# Altium schematic sheet PowerSupply.SchDoc: =ProjectName
size 420 x 297 mm; Author: SBH; CompanyName: WUT; DrawnBy: SBH; Organization: ISE-WUT; Address1: Warsaw Univeristy of Technology; Address2: Nowowiejska 15/19; Revision: -; SheetNumber: -; SheetTotal: -; EDA_Number: ARTIQ; Projet: ADC/DAC MEZZANINE; ModifiedBy: -; CreateDate: XX/XX/XXXX; CheckedDate: -; Title2: PowerSupply.SchDoc; DivGrp: ISE; Designer: SBH; ModifiedDate: -; ProjectName: ADC/DAC MEZZANINE
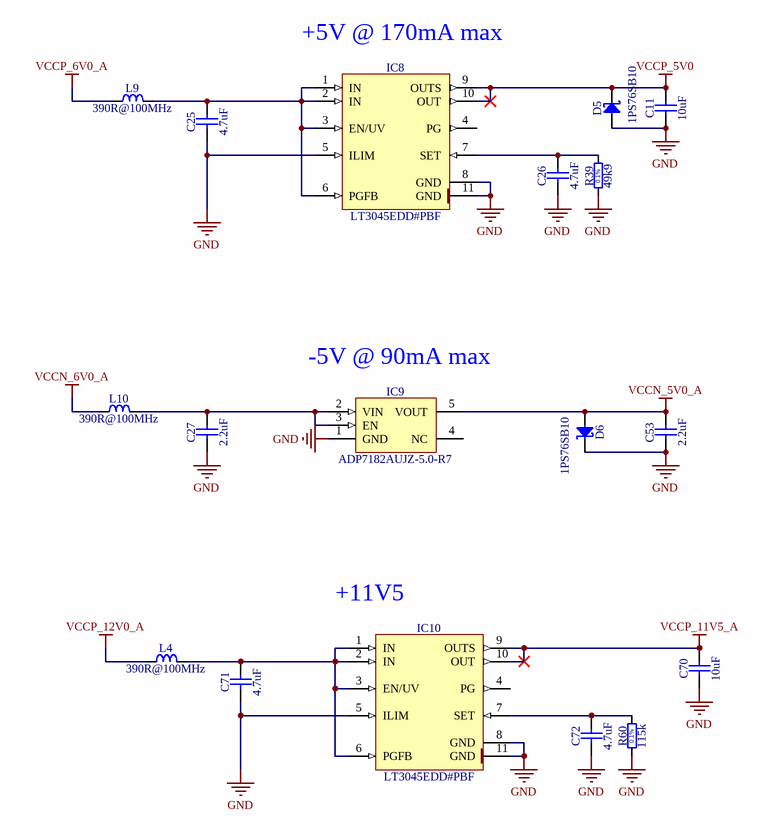
[diagram p0: PowerSupply.SchDoc]

## Parts
C11  10uF  [CAPC1608X87N]
C25  4.7uF  [CAPC1709X95N]
C26  4.7uF  [CAPC1709X95N]
C27  2.2uF  [CAPC1608X90N]
C53  2.2uF  [CAPC1608X90N]
C70  10uF  [CAPC1608X87N]
C71  4.7uF  [CAPC1709X95N]
C72  4.7uF  [CAPC1709X95N]
D5  1PS76SB10  [SOD2512X110N]
D6  1PS76SB10  [SOD2512X110N]
IC8  LT3045EDD#PBF  [SON50P300X300X80-11N-R175X248]
IC9  ADP7182AUJZ-5.0-R7  [SOT95P280X90-5N]
IC10  LT3045EDD#PBF  [SON50P300X300X80-11N-R175X248]
L4  390R@100MHz  [INDC1608X95N]
L9  390R@100MHz  [INDC1608X95N]
L10  390R@100MHz  [INDC1608X95N]
R39  49k9  [RESC1608X55N]
R60  115k  [RESC1608X55N]

## Nets
GND: C11.1 C25.1 C26.1 C27.1 C53.1 C70.1 C71.1 C72.1 D5.2(A) D6.1(C) IC8.5(ILIM) IC8.8(GND) IC8.11(GND) IC9.1(GND) IC10.5(ILIM) IC10.8(GND) IC10.11(GND) R39.1 R60.1
VCCN_5V0_A: C53.2 D6.2(A) IC9.5(VOUT)
VCCN_6V0_A: L10.1
VCCP_5V0: C11.2 D5.1(C) IC8.9(OUTS) IC8.10(OUT)
VCCP_6V0_A: L9.1
VCCP_11V5_A: C70.2 IC10.9(OUTS) IC10.10(OUT)
VCCP_12V0_A: L4.1
NetC25_2: C25.2 IC8.1(IN) IC8.2(IN) IC8.3(EN/UV) IC8.6(PGFB) L9.2
NetC26_2: C26.2 IC8.7(SET) R39.2
NetC27_2: C27.2 IC9.2(VIN) IC9.3(EN) L10.2
NetC71_2: C71.2 IC10.1(IN) IC10.2(IN) IC10.3(EN/UV) IC10.6(PGFB) L4.2
NetC72_2: C72.2 IC10.7(SET) R60.2

Not connected (* = marked no-connect by the designer): IC8 4(PG); IC9 4(NC); IC10 4(PG)

## Notes on the sheet
- (near IC8) +5V @ 170mA max
- (near IC9) -5V @ 90mA max
- (near IC10) +11V5
- Project/Equipment
- Document
- Designer
- Drawn by
- Check.by
- File
- Last Mod.
- Print Date
- Sheet
- Size
- A3
- of
- Rev
- (in symbol R0603_49K9_0.1%_0.063W_10PPM) 0.1%
- (in symbol R0603_115K_0.1%_0.063W_10PPM) 0.1%

## Library data of the parts
C11 C70 = CC0603_10UF_6.3V_20%_X5R: Non-polarised capacitor; Part Description: SMD Multilayer Chip Ceramic Capacitor; Manufacturer: GENERIC; Manufacturer1 Part Number: C0603C106M9PAC; Voltage: 6.3V; TC: X5R; Tolerance: ±20%; Part Number: CC0603_10UF_6.3V_20%_X5R; Component Kind: Standard; Component Type: Standard; Pin Count: 2; Value: 10uF; Status: Preferred; Manufacturer Part Number: CC0603_10uF_6.3V_20%_X5R; Case: 0603; Mounted: Yes; Socket: No; SMD: Yes; Sense: No; Manufacturer1 Example: KEMET; Manufacturer1 ComponentHeight: 0.95mm; HelpURL: \\cern.ch\dfs\Applications\Altium\Datasheets\CC0603_X5R_KEMET.pdf; Author: CERN DEM JLC; CreateDate: 2007-12-03; LatestRevisionDate: 2007-12-03
C25 C26 C71 C72 = CC0603_4.7UF_16V_10%_X5R: Non-polarised capacitor; Part Description: SMD Multilayer Chip Ceramic Capacitor; Manufacturer: GENERIC; Manufacturer1 Part Number: EMK107ABJ475KA-T; Voltage: 16V; TC: X5R; Tolerance: ±10%; Part Number: CC0603_4.7UF_16V_10%_X5R; Component Kind: Standard; Component Type: Standard; Pin Count: 2; Value: 4.7uF; Status: None; Manufacturer Part Number: CC0603_4.7UF_16V_10%_X5R; Case: 0603; Mounted: Yes; Socket: No; SMD: Yes; Sense: No; Manufacturer1 Example: TAIYO YUDEN; Manufacturer1 ComponentHeight: 0.95mm; HelpURL: \\cern.ch\dfs\Applications\Altium\Datasheets\CC0603_X7R_TAIYO-YUDEN_HIGH-VALUE.pdf; Author: CERN DEM JLC; CreateDate: 2013-12-16; LatestRevisionDate: 2014-09-16
C27 C53 = CC0603_2.2UF_10V_20%_X7R: Non-polarised capacitor; Part Description: SMD Multilayer Chip Ceramic Capacitor; Manufacturer: GENERIC; Manufacturer1 Part Number: LMK107B7225MA-T; Voltage: 10V; TC: X7R; Tolerance: ±20%; Part Number: CC0603_2.2UF_10V_20%_X7R; Component Kind: Standard; Component Type: Standard; Pin Count: 2; Value: 2.2uF; Status: Not Recommended; Manufacturer Part Number: CC0603_2.2UF_10V_20%_X7R; Case: 0603; Mounted: Yes; Socket: No; SMD: Yes; Sense: No; Manufacturer1 Example: TAIYO YUDEN; Manufacturer1 ComponentHeight: 0.9mm; HelpURL: \\cern.ch\dfs\Applications\Altium\Datasheets\CC0603_X7R_TAIYO-YUDEN_HIGH-VALUE.pdf; Author: CERN DEM JLC; CreateDate: 2011-06-22; LatestRevisionDate: 2011-06-27
D5 D6 = 1PS76SB10: Schottky Diode; Part Description: Schottky Barrier Single Diode; Manufacturer: NXP SEMICONDUCTORS; Voltage: 30V; Power: 200mA; PressFit: No; Bonding: No; Part Number: 1PS76SB10; Component Kind: Standard; Component Type: Standard; Device: 1PS76SB10; PackageDescription: Small Outline Diode Flat Lead (SOD-323), 1.70mm W X 1.25mm L X 1.10mm H body,  IPC Medium Density; Manufacturer Part Number: 1PS76SB10; Pin Count: 2; Case: SOD323; Mounted: Yes; Socket: No; SMD: Yes; Sense: No; ComponentHeight: 1.1mm; HelpURL: \\cern.ch\dfs\Applications\Altium\Datasheets\1PS76SB10.pdf; Author: CERN DEM JLC; CreateDate: 2012-12-06; LatestRevisionDate: 2012-12-06
IC8 IC10 = LT3045EDD#PBF: 20V, 500mA, Ultralow Noise, Ultrahigh PSRR Linear Regulator; Manufacturer: LINEAR TECHNOLOGY; PressFit: No; Bonding: No; Part Number: LT3045EDD#PBF; Component Kind: Standard; Component Type: Standard; Device: LT3045EDD#PBF; PackageDescription: SON, 0.50mm Pitch, 10-pin, 3.00mm W  X 3.00mm L X 0.80mm Height, (w/thermal tab 1.75 X 2.48 mm), IPC Medium Density; Part Description: 20V, 500mA, Ultralow Noise, Ultrahigh PSRR Linear Regulator; Manufacturer Part Number: LT3045EDD#PBF; Pin Count: 11; Case: SON10; Mounted: Yes; Socket: No; SMD: Yes; Sense: No; ComponentHeight: 0.8mm; HelpURL: \\cern.ch\dfs\Applications\Altium\Datasheets\LT3045EDD#PBF.pdf; Author: CERN DEM JLC; CreateDate: 2016-12-07; LatestRevisionDate: 2016-12-07
IC9 = ADP7182AUJZ-5.0-R7: –5V, 200 mA, Low Noise, Linear Regulator; Part Description: –5V, -200mA, Low Noise, Linear Regulator; Manufacturer: ANALOG DEVICES; PressFit: No; Bonding: No; Part Number: ADP7182AUJZ-5.0-R7; Component Kind: Standard; Component Type: Standard; Device: ADP7182AUJZ-5.0-R7; PackageDescription: SOT23, 0.95mm pitch; 5 pin, 1.75mm W X 3.00mm L, IPC Medium Density; Manufacturer Part Number: ADP7182AUJZ-5.0-R7; Pin Count: 5; Case: SOT23-5; Mounted: Yes; Socket: No; SMD: Yes; Sense: No; ComponentHeight: 0.9mm; HelpURL: \\cern.ch\dfs\Applications\Altium\Datasheets\ADP7182AUJZ-5.0-R7.pdf; Author: CERN DEM JLC; CreateDate: 17.03.2014; LatestRevisionDate: 17.03.2014
L4 L9 L10 = IND0603_TDK_MPZ1608R391A: Inductor; Part Description: SMT Chip Bead for Power Line; Manufacturer: TDK; Power: 1.2A; Resistance: 0.12R; Tolerance: ±25%; Part Number: IND0603_TDK_MPZ1608R391A; Component Kind: Standard; Component Type: Standard; Pin Count: 2; Value: 390R@100MHz; Status: None; Manufacturer Part Number: MPZ1608R391A; Case: 0603; Mounted: Yes; Socket: No; SMD: Yes; Sense: No; ComponentHeight: 0.95mm; HelpURL: \\cern.ch\dfs\Applications\Altium\Datasheets\IND0603_TDK_MPZ1608.pdf; Author: CERN DEM JLC; CreateDate: 2009-12-02; LatestRevisionDate: 2009-12-02
R39 = R0603_49K9_0.1%_0.063W_10PPM: Resistor - 0.1%; Part Description: Thin Film Chip Resistor; Manufacturer: GENERIC; Manufacturer1 Part Number: RN73C1J49K9BTDF; Power: 0.063W; TC: ±10ppm; Part Number: R0603_49K9_0.1%_0.063W_10PPM; Component Kind: Standard; Component Type: Standard; Pin Count: 2; Value: 49k9; Status: Not recommended; Tolerance: ±0.1%; Manufacturer Part Number: R0603_49K9_0.1%_0.063W_10PPM; Case: 0603; Mounted: Yes; Sense: No; Socket: No; SMD: Yes; Manufacturer1 Example: TYCO HOLSWORTHY; Manufacturer1 ComponentHeight: 0.5mm; HelpURL: \\cern.ch\dfs\Applications\Altium\Datasheets\R0603_Tyco_RN73.pdf; Author: CERN DEM JLC; CreateDate: 2007-12-03; LatestRevisionDate: 2008-03-13
R60 = R0603_115K_0.1%_0.063W_10PPM: Resistor - 0.1%; Part Description: Thin Film Chip Resistor; Manufacturer: GENERIC; Manufacturer1 Part Number: RN73C1J115KBTDF; Power: 0.063W; TC: ±10ppm; Part Number: R0603_115K_0.1%_0.063W_10PPM; Component Kind: Standard; Component Type: Standard; Pin Count: 2; Value: 115k; Status: Not recommended; Tolerance: ±0.1%; Manufacturer Part Number: R0603_115K_0.1%_0.063W_10PPM; Case: 0603; Mounted: Yes; Sense: No; Socket: No; SMD: Yes; Manufacturer1 Example: TYCO HOLSWORTHY; Manufacturer1 ComponentHeight: 0.5mm; HelpURL: \\cern.ch\dfs\Applications\Altium\Datasheets\R0603_Tyco_RN73.pdf; Author: CERN DEM JLC; CreateDate: 2007-12-03; LatestRevisionDate: 2008-03-13